# Altium schematic sheet FPGA_POWER_AND_CONFIGURATION.SchDoc: FPGA Power and Configuration
size B; Author: Michael Jones; Engineer: Michael Jones; Organization: Group VIII Technology; Address1: 1652 W 820 N; Address2: Provo; Address3: UT  84601; Address4: 801-379-0118; DocumentNumber: 4; Revision: A3; SheetNumber: 4; SheetTotal: 6
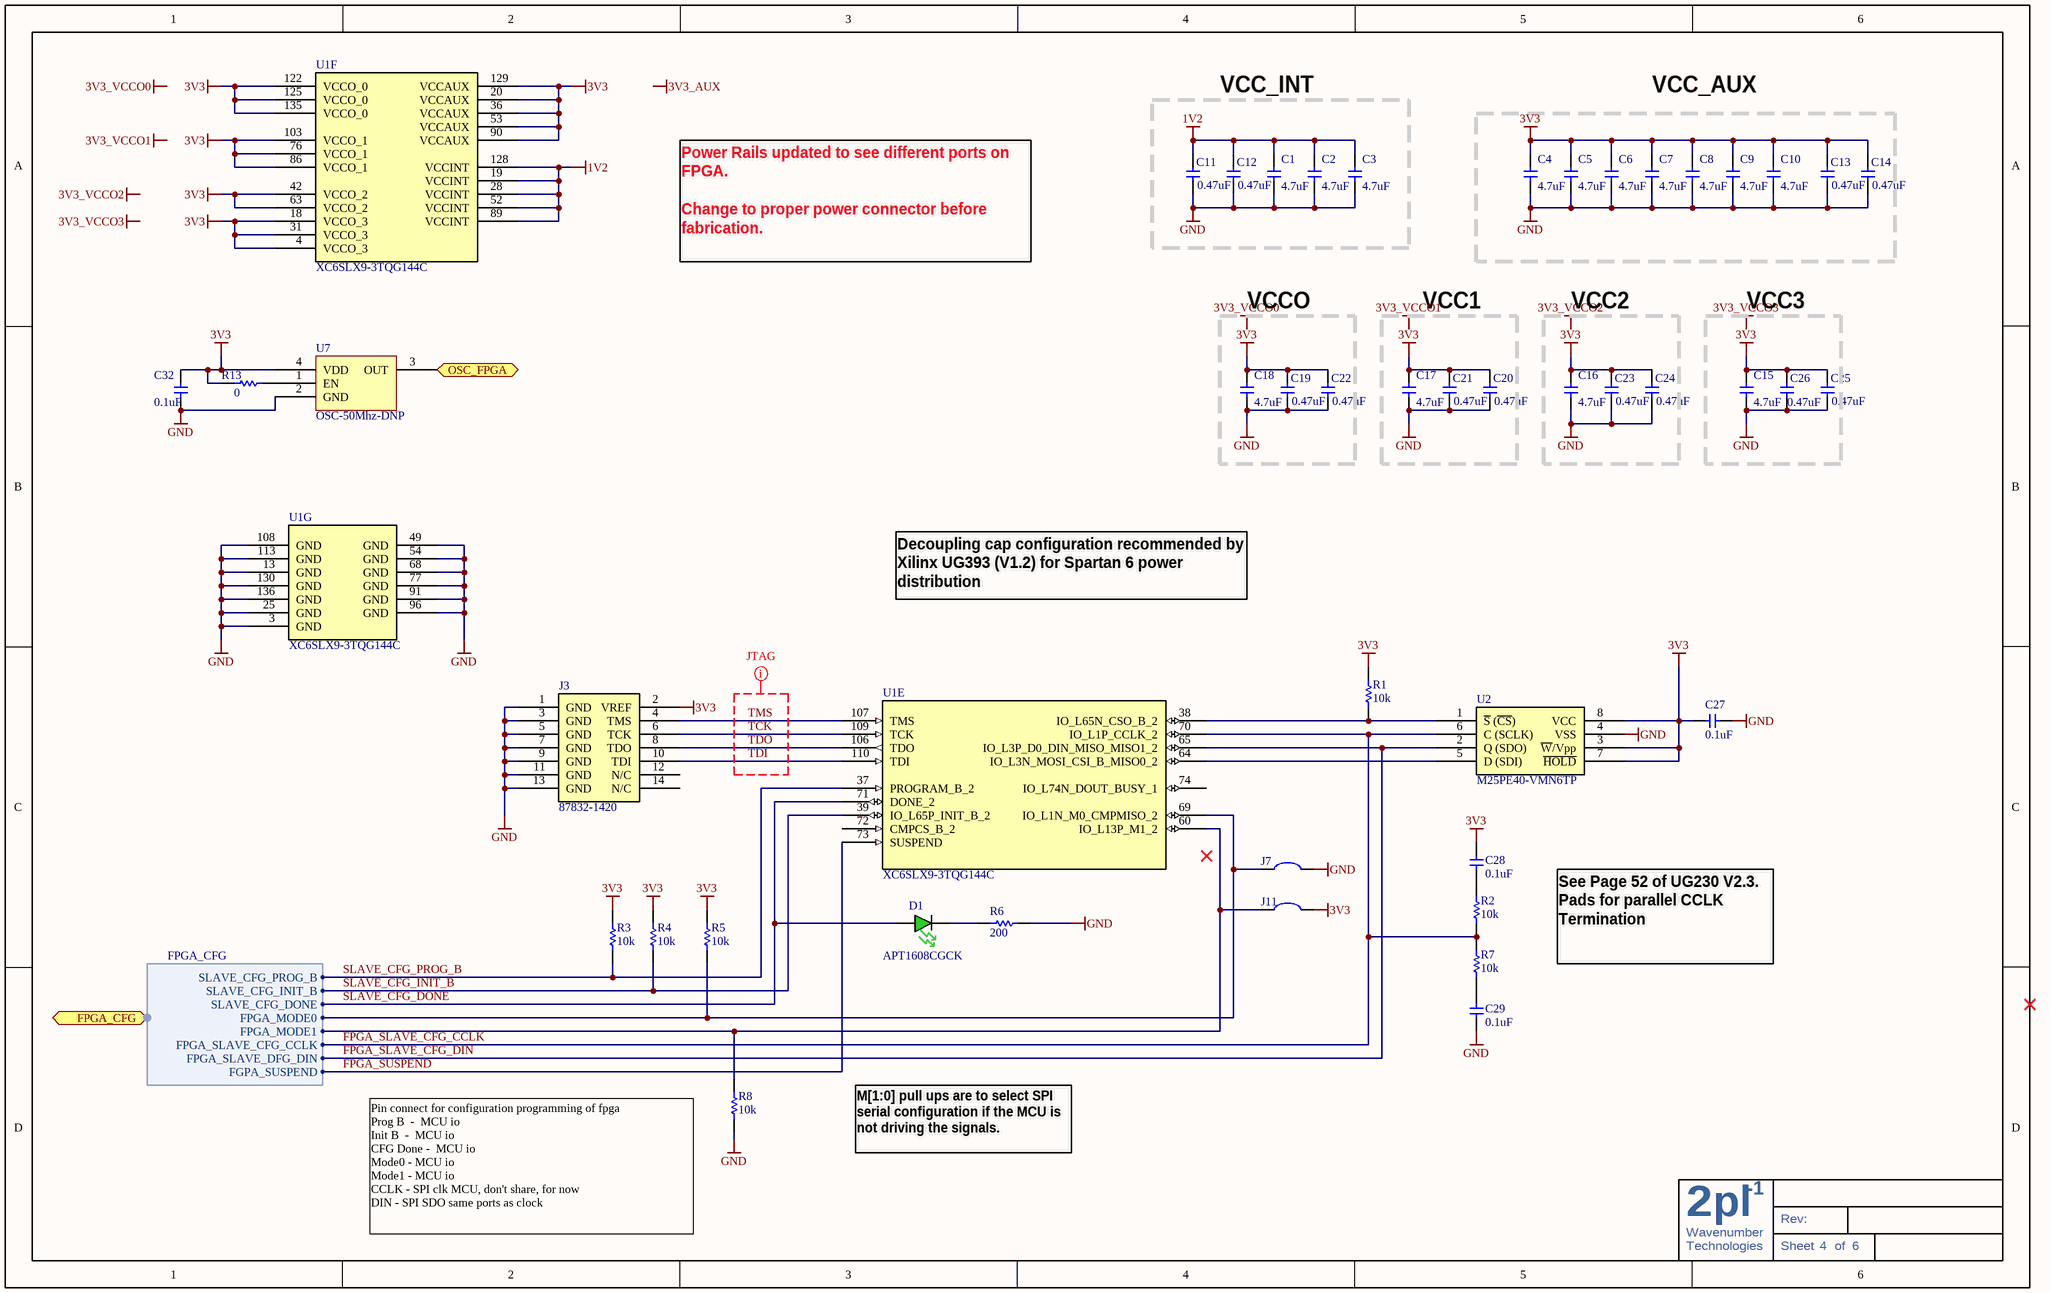
[diagram p0: FPGA_POWER_AND_CONFIGURATION.SchDoc]

## Parts
C1  4.7uF  [C0603]
C2  4.7uF  [C0603]
C3  4.7uF  [C0603]
C4  4.7uF  [C0603]
C5  4.7uF  [C0603]
C6  4.7uF  [C0603]
C7  4.7uF  [C0603]
C8  4.7uF  [C0603]
C9  4.7uF  [C0603]
C10  4.7uF  [C0603]
C11  0.47uF  [C0603]
C12  0.47uF  [C0603]
C13  0.47uF  [C0603]
C14  0.47uF  [C0603]
C15  4.7uF  [C0603]
C16  4.7uF  [C0603]
C17  4.7uF  [C0603]
C18  4.7uF  [C0603]
C19  0.47uF  [C0603]
C20  0.47uF  [C0603]
C21  0.47uF  [C0603]
C22  0.47uF  [C0603]
C23  0.47uF  [C0603]
C24  0.47uF  [C0603]
C25  0.47uF  [C0603]
C26  0.47uF  [C0603]
C27  0.1uF  [C0603]
C28  0.1uF  [C0603]
C29  0.1uF  [C0603]
C32  0.1uF  [C0603]
D1  APT1608CGCK  [LED_0603 - GREEN]
J3  87832-1420  [87832-1420]
J7  Solder Jumper  [SOLDER_JUMPER]  (value not drawn)
J11  Solder Jumper  [SOLDER_JUMPER]  (value not drawn)
R1  10k  [R0603]
R2  10k  [R0603]
R3  10k  [R0603]
R4  10k  [R0603]
R5  10k  [R0603]
R6  200  [R0603]
R7  10k  [R0603]
R8  10k  [R0603]
R13  0  [R0603]
U1  XC6SLX9-3TQG144C  [TQ144_L]  (parts E,F,G of 7)
U2  M25PE40-VMN6TP  [SOIC 8]
U7  OSC-50Mhz-DNP  [ASDMB - osc]

## Blocks framed on the sheet
VCC_INT: C1-C3 C11 C12
VCC_AUX: C4-C10 C13 C14
VCCO: C18 C19 C22
VCC1: C17 C20 C21
VCC2: C16 C23 C24
VCC3: C15 C25 C26

## Ports
FPGA_CFG (harness FPGA_CFG), OSC_FPGA (out)

## Harnesses
FPGA_CFG: SLAVE_CFG_PROG_B, SLAVE_CFG_INIT_B, SLAVE_CFG_DONE, FPGA_MODE0, FPGA_MODE1, FPGA_SLAVE_CFG_CCLK, FPGA_SLAVE_DFG_DIN, FGPA_SUSPEND

## Nets
1V2: C1.2 C2.2 C3.2 C11.2 C12.2 U1.19(VCCINT) U1.28(VCCINT) U1.52(VCCINT) U1.89(VCCINT) U1.128(VCCINT)
3V3: C4.2 C5.2 C6.2 C7.2 C8.2 C9.2 C10.2 C13.2 C14.2 C15.2 C16.2 C17.2 C18.2 C19.2 C20.2 C21.2 C22.2 C23.2 C24.2 C25.2 C26.2 C27.1 C28.2 C32.2 J3.2(VREF) J11.2 R1.2 R3.2 R4.2 R5.2 R13.2 U1.4(VCCO_3) U1.18(VCCO_3) U1.20(VCCAUX) U1.31(VCCO_3) U1.36(VCCAUX) U1.42(VCCO_2) U1.53(VCCAUX) U1.63(VCCO_2) U1.76(VCCO_1) U1.86(VCCO_1) U1.90(VCCAUX) U1.103(VCCO_1) U1.122(VCCO_0) U1.125(VCCO_0) U1.129(VCCAUX) U1.135(VCCO_0) U2.3(~{W}/Vpp) U2.7(~{HOLD}) U2.8(VCC) U7.4(VDD)
GND: C1.1 C2.1 C3.1 C4.1 C5.1 C6.1 C7.1 C8.1 C9.1 C10.1 C11.1 C12.1 C13.1 C14.1 C15.1 C16.1 C17.1 C18.1 C19.1 C20.1 C21.1 C22.1 C23.1 C24.1 C25.1 C26.1 C27.2 C29.1 C32.1 J3.1(GND) J3.3(GND) J3.5(GND) J3.7(GND) J3.9(GND) J3.11(GND) J3.13(GND) J7.2 R6.2 R8.1 U1.3(GND) U1.13(GND) U1.25(GND) U1.49(GND) U1.54(GND) U1.68(GND) U1.77(GND) U1.91(GND) U1.96(GND) U1.108(GND) U1.113(GND) U1.130(GND) U1.136(GND) U2.4(VSS) U7.2(GND)
FPGA_SLAVE_CFG_CCLK: R2.1 R7.2 U1.70(IO_L1P_CCLK_2) U2.6(C_(SCLK)) ; port FPGA_CFG.FPGA_SLAVE_CFG_CCLK
FPGA_SLAVE_CFG_DIN: U1.65(IO_L3P_D0_DIN_MISO_MISO1_2) U2.2(Q_(SDO)) ; port FPGA_CFG.FPGA_SLAVE_DFG_DIN
FPGA_SUSPEND: U1.73(SUSPEND) ; port FPGA_CFG.FGPA_SUSPEND
OSC_FPGA: U7.3(OUT) ; port OSC_FPGA
SLAVE_CFG_DONE: D1.A U1.71(DONE_2) ; port FPGA_CFG.SLAVE_CFG_DONE
SLAVE_CFG_INIT_B: R4.1 U1.39(IO_L65P_INIT_B_2) ; port FPGA_CFG.SLAVE_CFG_INIT_B
SLAVE_CFG_PROG_B: R3.1 U1.37(PROGRAM_B_2) ; port FPGA_CFG.SLAVE_CFG_PROG_B
TCK: J3.6(TCK) U1.109(TCK)
TDI: J3.10(TDI) U1.110(TDI)
TDO: J3.8(TDO) U1.106(TDO)
TMS: J3.4(TMS) U1.107(TMS)
NetC28_1: C28.1 R2.2
NetC29_2: C29.2 R7.1
NetD1_C: D1.C R6.1
NetJ7_1: J7.1 R5.1 U1.69(IO_L1N_M0_CMPMISO_2) ; port FPGA_CFG.FPGA_MODE0
NetJ11_1: J11.1 R8.2 U1.60(IO_L13P_M1_2) ; port FPGA_CFG.FPGA_MODE1
NetR1_1: R1.1 U1.38(IO_L65N_CSO_B_2) U2.1(~{S}_(~{CS}))
NetR13_1: R13.1 U7.1(EN)
NetU1_64: U1.64(IO_L3N_MOSI_CSI_B_MISO0_2) U2.5(D_(SDI))

Not connected (* = marked no-connect by the designer): J3 12(N/C) 14(N/C); U1 72(CMPCS_B_2) 74(IO_L74N_DOUT_BUSY_1)

## Layout directives
net class JTAG: TCK, TDI, TDO, TMS

## Notes on the sheet
- Power Rails updated to see different ports on FPGA.
  Change to proper power connector before fabrication.
- Decoupling cap configuration recommended by Xilinx UG393 (V1.2) for Spartan 6 power distribution
- See Page 52 of UG230 V2.3.   Pads for parallel CCLK Termination
- M[1:0] pull ups are to select SPI serial configuration if the MCU is not driving the signals.
- (near R8) Pin connect for configuration programming of fpga
  Prog B 	- 	MCU io
  Init B 	- 	MCU io
  CFG Done - 	MCU io
  Mode0	-	MCU io
  Mode1	-	MCU io
  CCLK	-	SPI clk MCU, don't share, for now
  DIN	-	SPI SDO same ports as clock
- Labels drawn without touching a wire or pin: 3V3_AUX, 3V3_VCCO0, 3V3_VCCO1, 3V3_VCCO2, 3V3_VCCO3
- 2
- Wavenumber
- pl
- -1
- Rev:
- Technologies
- Sheet
- of

## Library data of the parts
C1-C10 C15-C18 = GRM188R60J475KE19D: CAP CER 4.7UF 6.3V X5R 0603; Manufacturer: Murata Electronics North America; Capacitance: 4.7µF; Tolerance: ±10%; Supplier 1: Digi-Key; Supplier Part Number 1: 490-3297-1-ND; Manufacturer Part Number: GRM188R60J475KE19D; RoHS: RoHS Compliant; Category: Capacitors; Stock 1: 714091; Pricing 1: 10=0.214, 50=0.148, 100=0.1142, 250=0.08204, 500=0.0585, 1000=0.04281 (USD); Voltage - Rated: 6.3V; Temperature Coefficient: X5R; Mounting Type: Surface Mount, MLCC; Operating Temperature: -55°C ~ 85°C; Applications: General Purpose; Ratings: -; Package / Case: 0603 (1608 Metric); Size / Dimension: 0.063" L x 0.031" W (1.60mm x 0.80mm); Height: -; Thickness: 0.035" (0.90mm); Lead Spacing: -; Features: -; Packaging: Cut Tape (CT); Lead Style: -; ComponentLink1URL: http://search.murata.co.jp/Ceramy/image/img/PDF/ENG/GRM188R60J475KE19.pdf; ComponentLink1Description: http://search.murata.co.jp/Ceramy/image/img/PDF/ENG/GRM188R60J475KE19.pdf; Value: 4.7uF
C11-C14 C19-C26 = GCM188R71E474KA64D: CAP CER .47UF 25V X7R 0603; Manufacturer: Murata Electronics North America; Capacitance: 0.47µF; Tolerance: ±10%; Supplier 1: Digi-Key; Supplier Part Number 1: 490-4776-1-ND; Manufacturer Part Number: GCM188R71E474KA64D; RoHS: RoHS Compliant; Category: Capacitors; Stock 1: 120782; Pricing 1: 10=0.248, 50=0.1444, 100=0.1155, 250=0.08252, 500=0.0561, 1000=0.04538 (USD); Voltage - Rated: 25V; Temperature Coefficient: X7R; Mounting Type: Surface Mount, MLCC; Operating Temperature: -55°C ~ 125°C; Applications: Automotive; Ratings: AEC-Q200; Package / Case: 0603 (1608 Metric); Size / Dimension: 0.063" L x 0.031" W (1.60mm x 0.80mm); Height: -; Thickness: 0.035" (0.90mm); Lead Spacing: -; Features: -; Packaging: Cut Tape (CT); Lead Style: -; ComponentLink1URL: http://search.murata.co.jp/Ceramy/image/img/PDF/ENG/GCM188R71E474KA64.pdf; ComponentLink1Description: http://search.murata.co.jp/Ceramy/image/img/PDF/ENG/GCM188R71E474KA64.pdf; Value: 0.47uF
C27-C29 C32 = GRM188R71H104KA93D: CAP CER .1UF 50V 10% X7R 0603; Manufacturer: Murata Electronics North America; Capacitance: 0.1µF; Manufacturer Part Number: GRM188R71H104KA93D; Value: CAP CER .1UF 50V 10% X7R 0603; Supplier 1: Digi-Key; Supplier Part Number 1: 490-1519-1-ND; RoHS: RoHS Compliant; Category: Capacitors; Stock 1: 9370695; Pricing 1: 10=0.037, 100=0.0221, 500=0.01276, 1000=0.00884 (USD); Voltage - Rated: 50V; Tolerance: ±10%; Temperature Coefficient: X7R; Mounting Type: Surface Mount, MLCC; Operating Temperature: -55°C ~ 125°C; Features: -; Applications: General Purpose; Ratings: -; Package / Case: 0603 (1608 Metric); Size / Dimension: 0.063" L x 0.031" W (1.60mm x 0.80mm); Lead Spacing: -; Thickness: 0.80mm; Packaging: Cut Tape (CT); Lead Style: -; ComponentLink1URL: http://search.murata.co.jp/Ceramy/image/img/PDF/ENG/GRM188R71H104KA93.pdf; ComponentLink1Description: http://search.murata.co.jp/Ceramy/image/img/PDF/ENG/GRM188R71H104KA93.pdf
D1 = APT1608CGCK: LED 1.6X0.8MM 570NM GRN CLR SMD; Manufacturer: Kingbright Corp; Color: Green; Current - Test: 20mA; Wavelength - Peak: 574nm; Millicandela Rating: 50mcd; Voltage - Forward (Vf) Typ: 2.1V; Lens Type: Clear; Lens Style/Size: Rectangle, 1.2mm x 0.8mm; Viewing Angle: 120°; Value: APT1608CGCK; Supplier 1: Digi-Key; Supplier Part Number 1: 754-1116-2-ND; Manufacturer Part Number: APT1608CGCK; RoHS: RoHS Compliant; Category: Optoelectronics; Stock 1: 94000; Pricing 1: 2000=0.051, 6000=0.045, 10000=0.043 (USD); Luminous Flux @ Current - Test: -; Wavelength - Dominant: 570nm; Size / Dimension: 1.60mm L x 0.80mm W; Height: 0.75mm; Package / Case: 0603 (1608 Metric); Mounting Type: Surface Mount; Packaging: Tape & Reel (TR); ComponentLink1URL: http://www.us.kingbright.com/images/catalog/SPEC/APT1608CGCK.pdf; ComponentLink1Description: http://www.us.kingbright.com/images/catalog/SPEC/APT1608CGCK.pdf
J3 = XILINX_JTAG: CONN HEADER 14POS 2MM VERT SMD; Manufacturer: Molex Connector Corporation; Source Part Number: WM18641-ND; Manufacturer Part Number: 87832-1420; Source: Digikey; Value: CONN HEADER 14POS 2MM VERT SMD; ROHS Certificate: *
J7 J11 = Solder Jumper: Solder/Configuration Jumper; Manufacturer: n/a; Manufacturer Part Number: n/a; Source: n/a; Source Part Number: n/a; ROHS Certificate: n/a
R1-R5 R7 R8 = ERJ-3EKF1002V: RES 10.0K OHM 1/10W 1% 0603 SMD; Manufacturer: Panasonic - ECG; Power (Watts): 0.1W, 1/10W; Temperature Coefficient: ±100ppm/°C; Manufacturer Part Number: ERJ-3EKF1002V; Value: 10k; Supplier 1: Digi-Key; RoHS: RoHS Compliant; Category: Resistors; Stock 1: 11168880; Pricing 1: 1=0.04, 50=0.015, 100=0.0114, 250=0.00844, 500=0.00624, 1000=0.00416 (USD); Resistance (Ohms): 10.0K; Composition: Thick Film; Features: -; Tolerance: ±1%; Size / Dimension: 0.063" L x 0.031" W (1.60mm x 0.80mm); Height: 0.018" (0.45mm); Lead Style: Surface Mount (SMD - SMT); Packaging: Cut Tape (CT); Package / Case: 0603 (1608 Metric); ComponentLink1URL: http://industrial.panasonic.com/www-cgi/jvcr13pz.cgi?E+PZ+3+AOA0002+ERJ3EKF1002V+7+WW; ComponentLink1Description: http://industrial.panasonic.com/www-cgi/jvcr13pz.cgi?E+PZ+3+AOA0002+ERJ3EKF1002V+7+WW; Supplier Part Number 1: P10.0KHCT-ND
R6 = ERJ-3EKF2000V: RES 200 OHM 1/10W 1% 0603 SMD; Manufacturer: Panasonic - ECG; Power (Watts): 0.1W, 1/10W; Temperature Coefficient: ±100ppm/°C; Manufacturer Part Number: ERJ-3EKF2000V; Value: RES 200 OHM 1/10W 1% 0603 SMD; Supplier 1: Digi-Key; Supplier Part Number 1: P200HCT-ND; RoHS: RoHS Compliant; Category: Resistors; Stock 1: 1279595; Pricing 1: 1=0.04, 50=0.015, 100=0.0114, 250=0.00844, 500=0.00624, 1000=0.00416 (USD); Resistance (Ohms): 200; Composition: Thick Film; Features: -; Tolerance: ±1%; Size / Dimension: 0.063" L x 0.031" W (1.60mm x 0.80mm); Height: 0.018" (0.45mm); Lead Style: Surface Mount (SMD - SMT); Packaging: Cut Tape (CT); Package / Case: 0603 (1608 Metric); ComponentLink1URL: http://industrial.panasonic.com/www-cgi/jvcr13pz.cgi?E+PZ+3+AOA0002+ERJ3EKF2000V+7+WW; ComponentLink1Description: http://industrial.panasonic.com/www-cgi/jvcr13pz.cgi?E+PZ+3+AOA0002+ERJ3EKF2000V+7+WW
R13 = ERJ-3GEY0R00V: RES ZERO OHM 1/10W 5% 0603 SMD; Manufacturer: Panasonic - ECG; Description: RES 0.0 OHM 1/10W 0603 SMD; Resistance (Ohms): 0.0; Power (Watts): 0.1W, 1/10W; Temperature Coefficient: -100/ +600ppm/°C; Tolerance: Jumper; Manufacturer Part Number: ERJ-3GEY0R00V; Value: 0; Supplier 1: Digi-Key; RoHS: RoHS Compliant; Category: Resistors; Stock 1: 28391645; Pricing 1: 1=0.03, 50=0.0104, 100=0.0079, 250=0.00584, 500=0.00432, 1000=0.00288 (USD); Composition: Thick Film; Features: -; Size / Dimension: 0.063" L x 0.031" W (1.60mm x 0.80mm); Height: 0.018" (0.45mm); Lead Style: Surface Mount (SMD - SMT); Packaging: Cut Tape (CT); Package / Case: 0603 (1608 Metric); ComponentLink1URL: http://industrial.panasonic.com/www-cgi/jvcr13pz.cgi?E+PZ+3+AOA0001+ERJ3GEY0R00V+7+WW; ComponentLink1Description: http://industrial.panasonic.com/www-cgi/jvcr13pz.cgi?E+PZ+3+AOA0001+ERJ3GEY0R00V+7+WW; Supplier Part Number 1: P0.0GCT-ND
U1 = XC6SLX9-3TQG144C: IC FPAG SPARTAN 6 9K 144TQFP; Manufacturer: Xilinx Inc; Number of Logic Elements/Cells: 9152; Number of LABs/CLBs: 715; Total RAM Bits: 589824; Number of I /O: 102; Voltage - Supply: 1.14 V ~ 1.26 V; Supplier 1: Digi-Key; Supplier Part Number 1: 122-1747-ND; Manufacturer Part Number: XC6SLX9-3TQG144C; RoHS: RoHS Compliant; Category: Integrated Circuits (ICs); Stock 1: 77; Pricing 1: 1=17.22 (USD); Number of Gates: -; Mounting Type: Surface Mount; Operating Temperature: 0°C ~ 85°C; Package / Case: 144-LQFP; Supplier Device Package: 144-TQFP (20x20); ComponentLink1URL: http://www.xilinx.com/support/documentation/data_sheets/ds160.pdf; ComponentLink1Description: http://www.xilinx.com/support/documentation/data_sheets/ds160.pdf; Value: XC6SLX9-3TQG144C
U2 = M25PE40-VMN6TP: IC FLASH 4MBIT 75MHZ 8SOIC; Manufacturer: Numonyx - A DIVISION OF MICRON SEMICONDUCTOR PRODUCTS, INC.; Memory Size: 4M (512K x 8); Interface: SPI, 3-Wire Serial; Voltage - Supply: 2.7 V ~ 3.6 V; Supplier 1: Digi-Key; Supplier Part Number 1: M25PE40-VMN6TPCT-ND; Manufacturer Part Number: M25PE40-VMN6TP; RoHS: RoHS Compliant; Category: Integrated Circuits (ICs); Pricing 1: 1=1.86, 10=1.666, 25=1.47, 100=1.323, 250=1.15152, 500=1.029, 1000=0.8085 (USD); Format - Memory: FLASH; Memory Type: FLASH; Speed: 75MHz; Operating Temperature: -40°C ~ 85°C; Package / Case: 8-SOIC (0.154", 3.90mm Width); Supplier Device Package: 8-SO; Packaging: Cut Tape (CT); ComponentLink1URL: http://media.digikey.com/pdf/Data%20Sheets/Micron%20Technology%20Inc%20PDFs/M25PE40.pdf; ComponentLink1Description: http://media.digikey.com/pdf/Data%20Sheets/Micron%20Technology%20Inc%20PDFs/M25PE40.pdf; Stock 1: 1941; Value: M25PE40-VMN6TP
U7 = OSC - ASDMB-50.000MHZ-LC-T: OSC MEMS 50.000 MHZ SMD; Manufacturer: Abracon Corporation; Frequency: 50MHz; Function: Tri-State (Output Enable); Output: CMOS; Voltage - Supply: 1.8 V ~ 3.3 V; Frequency Stability: ±50ppm; Current - Supply (Max): 16mA; Current - Supply (Disable) (Max): 15µA; Supplier 1: Digi-Key; Manufacturer Part Number: ASDMB-50.000MHZ-LC-T; RoHS: RoHS Compliant; Category: Crystals and Oscillators; Stock 1: 967; Pricing 1: 1=1.69, 10=1.463, 50=1.2826, 100=1.0125, 500=0.855 (USD); Type: MEMS (Silicon); Operating Temperature: -40°C ~ 85°C; Mounting Type: Surface Mount; Size / Dimension: 0.098" L x 0.079" W (2.50mm x 2.00mm); Height: 0.035" (0.90mm); Package / Case: 4-SMD, No Lead (DFN, LCC); Packaging: Cut Tape (CT); ComponentLink1URL: http://www.abracon.com/Oscillators/ASDMB.pdf; ComponentLink1Description: http://www.abracon.com/Oscillators/ASDMB.pdf; Supplier Part Number 1: 535-11738-1-ND; Value: OSC - 50Mhz